# Altium schematic sheet Kasli-SOC_bank12.SchDoc: Bank12
size 420 x 297 mm; CheckedBy: G.Kasprowicz; Author: F.Switakowski; CompanyName: WUT ISE; DrawnBy: F.Switakowski; Organization: WUT ISE; Address1: PW ISE; Address2: Nowowiejska 15/19 00-665 Warsaw; Address3: gkasprow@gmail.com; DocumentNumber: 6; Revision: 1; SheetNumber: 6; SheetTotal: 18; ModifiedBy: -; CheckedDate: -; Title2: EEM LVDS; DivGrp: WUT ISE; Designer: G.Kasprowicz; ModifiedDate: -; ProjectName: Sensor Box
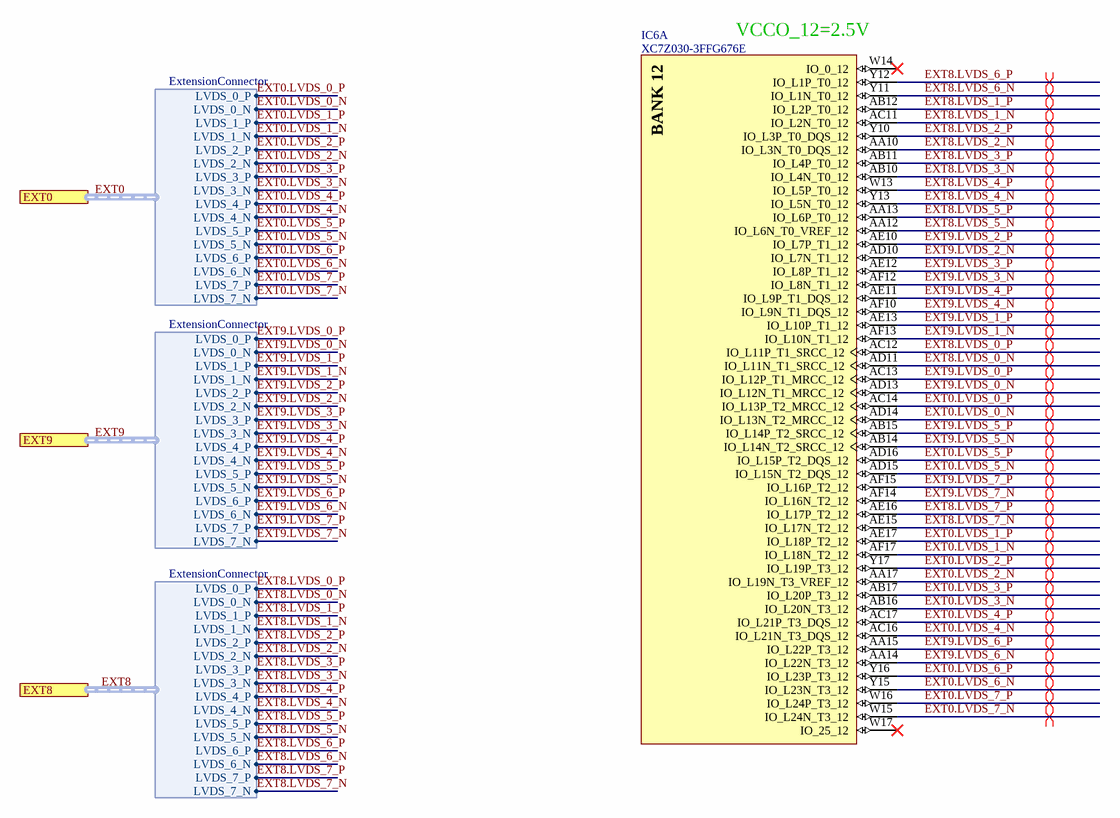
[diagram p0: Kasli-SOC_bank12.SchDoc]

## Parts
IC6  XC7Z030-3FFG676E  [BGA676C100P26X26_2700X2700X324]  (part A of 14)

## Ports
EXT0 (harness ExtensionConnector), EXT8 (harness ExtensionConnector), EXT9 (harness ExtensionConnector)

## Harnesses
ExtensionConnector: LVDS_0_N, LVDS_0_P, LVDS_1_N, LVDS_1_P, LVDS_2_N, LVDS_2_P, LVDS_3_N, LVDS_3_P, LVDS_4_N, LVDS_4_P, LVDS_5_N, LVDS_5_P, LVDS_6_N, LVDS_6_P, LVDS_7_N, LVDS_7_P

## Nets
EXT0.LVDS_0_N: IC6.AD14(IO_L13N_T2_MRCC_12) ; port EXT0.LVDS_0_N
EXT0.LVDS_0_P: IC6.AC14(IO_L13P_T2_MRCC_12) ; port EXT0.LVDS_0_P
EXT0.LVDS_1_N: IC6.AF17(IO_L18N_T2_12) ; port EXT0.LVDS_1_N
EXT0.LVDS_1_P: IC6.AE17(IO_L18P_T2_12) ; port EXT0.LVDS_1_P
EXT0.LVDS_2_N: IC6.AA17(IO_L19N_T3_VREF_12) ; port EXT0.LVDS_2_N
EXT0.LVDS_2_P: IC6.Y17(IO_L19P_T3_12) ; port EXT0.LVDS_2_P
EXT0.LVDS_3_N: IC6.AB16(IO_L20N_T3_12) ; port EXT0.LVDS_3_N
EXT0.LVDS_3_P: IC6.AB17(IO_L20P_T3_12) ; port EXT0.LVDS_3_P
EXT0.LVDS_4_N: IC6.AC16(IO_L21N_T3_DQS_12) ; port EXT0.LVDS_4_N
EXT0.LVDS_4_P: IC6.AC17(IO_L21P_T3_DQS_12) ; port EXT0.LVDS_4_P
EXT0.LVDS_5_N: IC6.AD15(IO_L15N_T2_DQS_12) ; port EXT0.LVDS_5_N
EXT0.LVDS_5_P: IC6.AD16(IO_L15P_T2_DQS_12) ; port EXT0.LVDS_5_P
EXT0.LVDS_6_N: IC6.Y15(IO_L23N_T3_12) ; port EXT0.LVDS_6_N
EXT0.LVDS_6_P: IC6.Y16(IO_L23P_T3_12) ; port EXT0.LVDS_6_P
EXT0.LVDS_7_N: IC6.W15(IO_L24N_T3_12) ; port EXT0.LVDS_7_N
EXT0.LVDS_7_P: IC6.W16(IO_L24P_T3_12) ; port EXT0.LVDS_7_P
EXT8.LVDS_0_N: IC6.AD11(IO_L11N_T1_SRCC_12) ; port EXT8.LVDS_0_N
EXT8.LVDS_0_P: IC6.AC12(IO_L11P_T1_SRCC_12) ; port EXT8.LVDS_0_P
EXT8.LVDS_1_N: IC6.AC11(IO_L2N_T0_12) ; port EXT8.LVDS_1_N
EXT8.LVDS_1_P: IC6.AB12(IO_L2P_T0_12) ; port EXT8.LVDS_1_P
EXT8.LVDS_2_N: IC6.AA10(IO_L3N_T0_DQS_12) ; port EXT8.LVDS_2_N
EXT8.LVDS_2_P: IC6.Y10(IO_L3P_T0_DQS_12) ; port EXT8.LVDS_2_P
EXT8.LVDS_3_N: IC6.AB10(IO_L4N_T0_12) ; port EXT8.LVDS_3_N
EXT8.LVDS_3_P: IC6.AB11(IO_L4P_T0_12) ; port EXT8.LVDS_3_P
EXT8.LVDS_4_N: IC6.Y13(IO_L5N_T0_12) ; port EXT8.LVDS_4_N
EXT8.LVDS_4_P: IC6.W13(IO_L5P_T0_12) ; port EXT8.LVDS_4_P
EXT8.LVDS_5_N: IC6.AA12(IO_L6N_T0_VREF_12) ; port EXT8.LVDS_5_N
EXT8.LVDS_5_P: IC6.AA13(IO_L6P_T0_12) ; port EXT8.LVDS_5_P
EXT8.LVDS_6_N: IC6.Y11(IO_L1N_T0_12) ; port EXT8.LVDS_6_N
EXT8.LVDS_6_P: IC6.Y12(IO_L1P_T0_12) ; port EXT8.LVDS_6_P
EXT8.LVDS_7_N: IC6.AE15(IO_L17N_T2_12) ; port EXT8.LVDS_7_N
EXT8.LVDS_7_P: IC6.AE16(IO_L17P_T2_12) ; port EXT8.LVDS_7_P
EXT9.LVDS_0_N: IC6.AD13(IO_L12N_T1_MRCC_12) ; port EXT9.LVDS_0_N
EXT9.LVDS_0_P: IC6.AC13(IO_L12P_T1_MRCC_12) ; port EXT9.LVDS_0_P
EXT9.LVDS_1_N: IC6.AF13(IO_L10N_T1_12) ; port EXT9.LVDS_1_N
EXT9.LVDS_1_P: IC6.AE13(IO_L10P_T1_12) ; port EXT9.LVDS_1_P
EXT9.LVDS_2_N: IC6.AD10(IO_L7N_T1_12) ; port EXT9.LVDS_2_N
EXT9.LVDS_2_P: IC6.AE10(IO_L7P_T1_12) ; port EXT9.LVDS_2_P
EXT9.LVDS_3_N: IC6.AF12(IO_L8N_T1_12) ; port EXT9.LVDS_3_N
EXT9.LVDS_3_P: IC6.AE12(IO_L8P_T1_12) ; port EXT9.LVDS_3_P
EXT9.LVDS_4_N: IC6.AF10(IO_L9N_T1_DQS_12) ; port EXT9.LVDS_4_N
EXT9.LVDS_4_P: IC6.AE11(IO_L9P_T1_DQS_12) ; port EXT9.LVDS_4_P
EXT9.LVDS_5_N: IC6.AB14(IO_L14N_T2_SRCC_12) ; port EXT9.LVDS_5_N
EXT9.LVDS_5_P: IC6.AB15(IO_L14P_T2_SRCC_12) ; port EXT9.LVDS_5_P
EXT9.LVDS_6_N: IC6.AA14(IO_L22N_T3_12) ; port EXT9.LVDS_6_N
EXT9.LVDS_6_P: IC6.AA15(IO_L22P_T3_12) ; port EXT9.LVDS_6_P
EXT9.LVDS_7_N: IC6.AF14(IO_L16N_T2_12) ; port EXT9.LVDS_7_N
EXT9.LVDS_7_P: IC6.AF15(IO_L16P_T2_12) ; port EXT9.LVDS_7_P

Not connected (* = marked no-connect by the designer): IC6 W14(IO_0_12)* W17(IO_25_12)*

## Buses and harness runs
harness EXT0 = port EXT0
harness EXT8 = port EXT8
harness EXT9 = port EXT9

## Layout directives
differential pair: EXT0.LVDS_0_N, EXT0.LVDS_0_P, EXT0.LVDS_1_N, EXT0.LVDS_1_P, EXT0.LVDS_2_N, EXT0.LVDS_2_P, EXT0.LVDS_3_N, EXT0.LVDS_3_P, EXT0.LVDS_4_N, EXT0.LVDS_4_P, EXT0.LVDS_5_N, EXT0.LVDS_5_P, EXT0.LVDS_6_N, EXT0.LVDS_6_P, EXT0.LVDS_7_N, EXT0.LVDS_7_P, EXT8.LVDS_0_N, EXT8.LVDS_0_P, EXT8.LVDS_1_N, EXT8.LVDS_1_P, EXT8.LVDS_2_N, EXT8.LVDS_2_P, EXT8.LVDS_3_N, EXT8.LVDS_3_P, EXT8.LVDS_4_N, EXT8.LVDS_4_P, EXT8.LVDS_5_N, EXT8.LVDS_5_P, EXT8.LVDS_6_N, EXT8.LVDS_6_P, EXT8.LVDS_7_N, EXT8.LVDS_7_P, EXT9.LVDS_0_N, EXT9.LVDS_0_P, EXT9.LVDS_1_N, EXT9.LVDS_1_P, EXT9.LVDS_2_N, EXT9.LVDS_2_P, EXT9.LVDS_3_N, EXT9.LVDS_3_P, EXT9.LVDS_4_N, EXT9.LVDS_4_P, EXT9.LVDS_5_N, EXT9.LVDS_5_P, EXT9.LVDS_6_N, EXT9.LVDS_6_P, EXT9.LVDS_7_N, EXT9.LVDS_7_P

## Notes on the sheet
- (near IC6) VCCO_12=2.5V
- Project/Equipment
- Document
- Designer
- Drawn by
- Check.by
- Copyright WUT ISE 2020.
  This documentation describes Open Hardware and is licensed under the CERN OHL v.1.2. You may redistribute and modify this documentation under the terms of the CERN OHL v.1.2. (http://ohwr.org/CERNOHL). This documentation is distributed WITHOUT ANY EXPRESS OR IMPLIED WARRANTY, INCLUDING OF MERCHANTABILITY, SATISFACTORY QUALITY AND FITNESS FOR A PARTICULAR PURPOSE. Please see the CERN OHL v.1.2 for applicable conditions.
- Contact
- File
- Last Mod.
- Print Date
- Sheet
- Size
- A3
- of
- Rev
- (in symbol XC7Z030-2FFG676I, part A) BANK 12

## Library data of the parts
IC6 = XC7Z030-2FFG676I: 733 MHz Zynq™-7000 AP SoC, 130 PS I/O, 254 FPGA I/O, 676-Ball BGA, Speed Grade 2, Industrial Grade, Pb-Free; Part Description: Zynq™-7000 All Programmable SoC, Dual-core ARM® Cortex™-A9 CPU, 676-Ball BGA, Speed Grade 2, Industrial Grade, Pb-Free; Manufacturer: XILINX; PressFit: No; Bonding: No; Part Number: XC7Z030-3FFG676E; Component Kind: Standard; Component Type: Standard; Device: XC7Z030-2FFG676I; PackageDescription: BGA, 1.00mm Pitch, Square; 676 Pin, 26 Columns X 26 Rows, 27.00mm X 27.00mm X 2.60mm H; Manufacturer Part Number: XC7Z030-3FFG676E; Pin Count: 676; Case: BGA676; Mounted: Yes; Socket: No; SMD: Yes; Sense: No; ComponentHeight: 3.24mm; HelpURL: \\cern.ch\dfs\Applications\Altium\Datasheets\XC7Z030-2FFG676I.pdf; ComponentLink1URL: \\cern.ch\dfs\Applications\Altium\Datasheets\XC7Z030-2FFG676I_Package.pdf; ComponentLink1Description: Package; ComponentLink2URL: \\cern.ch\dfs\Applications\Altium\Datasheets\XC7Z030-2FFG676I_Pinout.txt; ComponentLink2Description: Pinout; Author: CERN DEM JLC; CreateDate: 29/04/2014; LatestRevisionDate: 29/04/2014